# Altium schematic sheet A.SchDoc
size A3; SheetNumber: 1; SheetTotal: 5
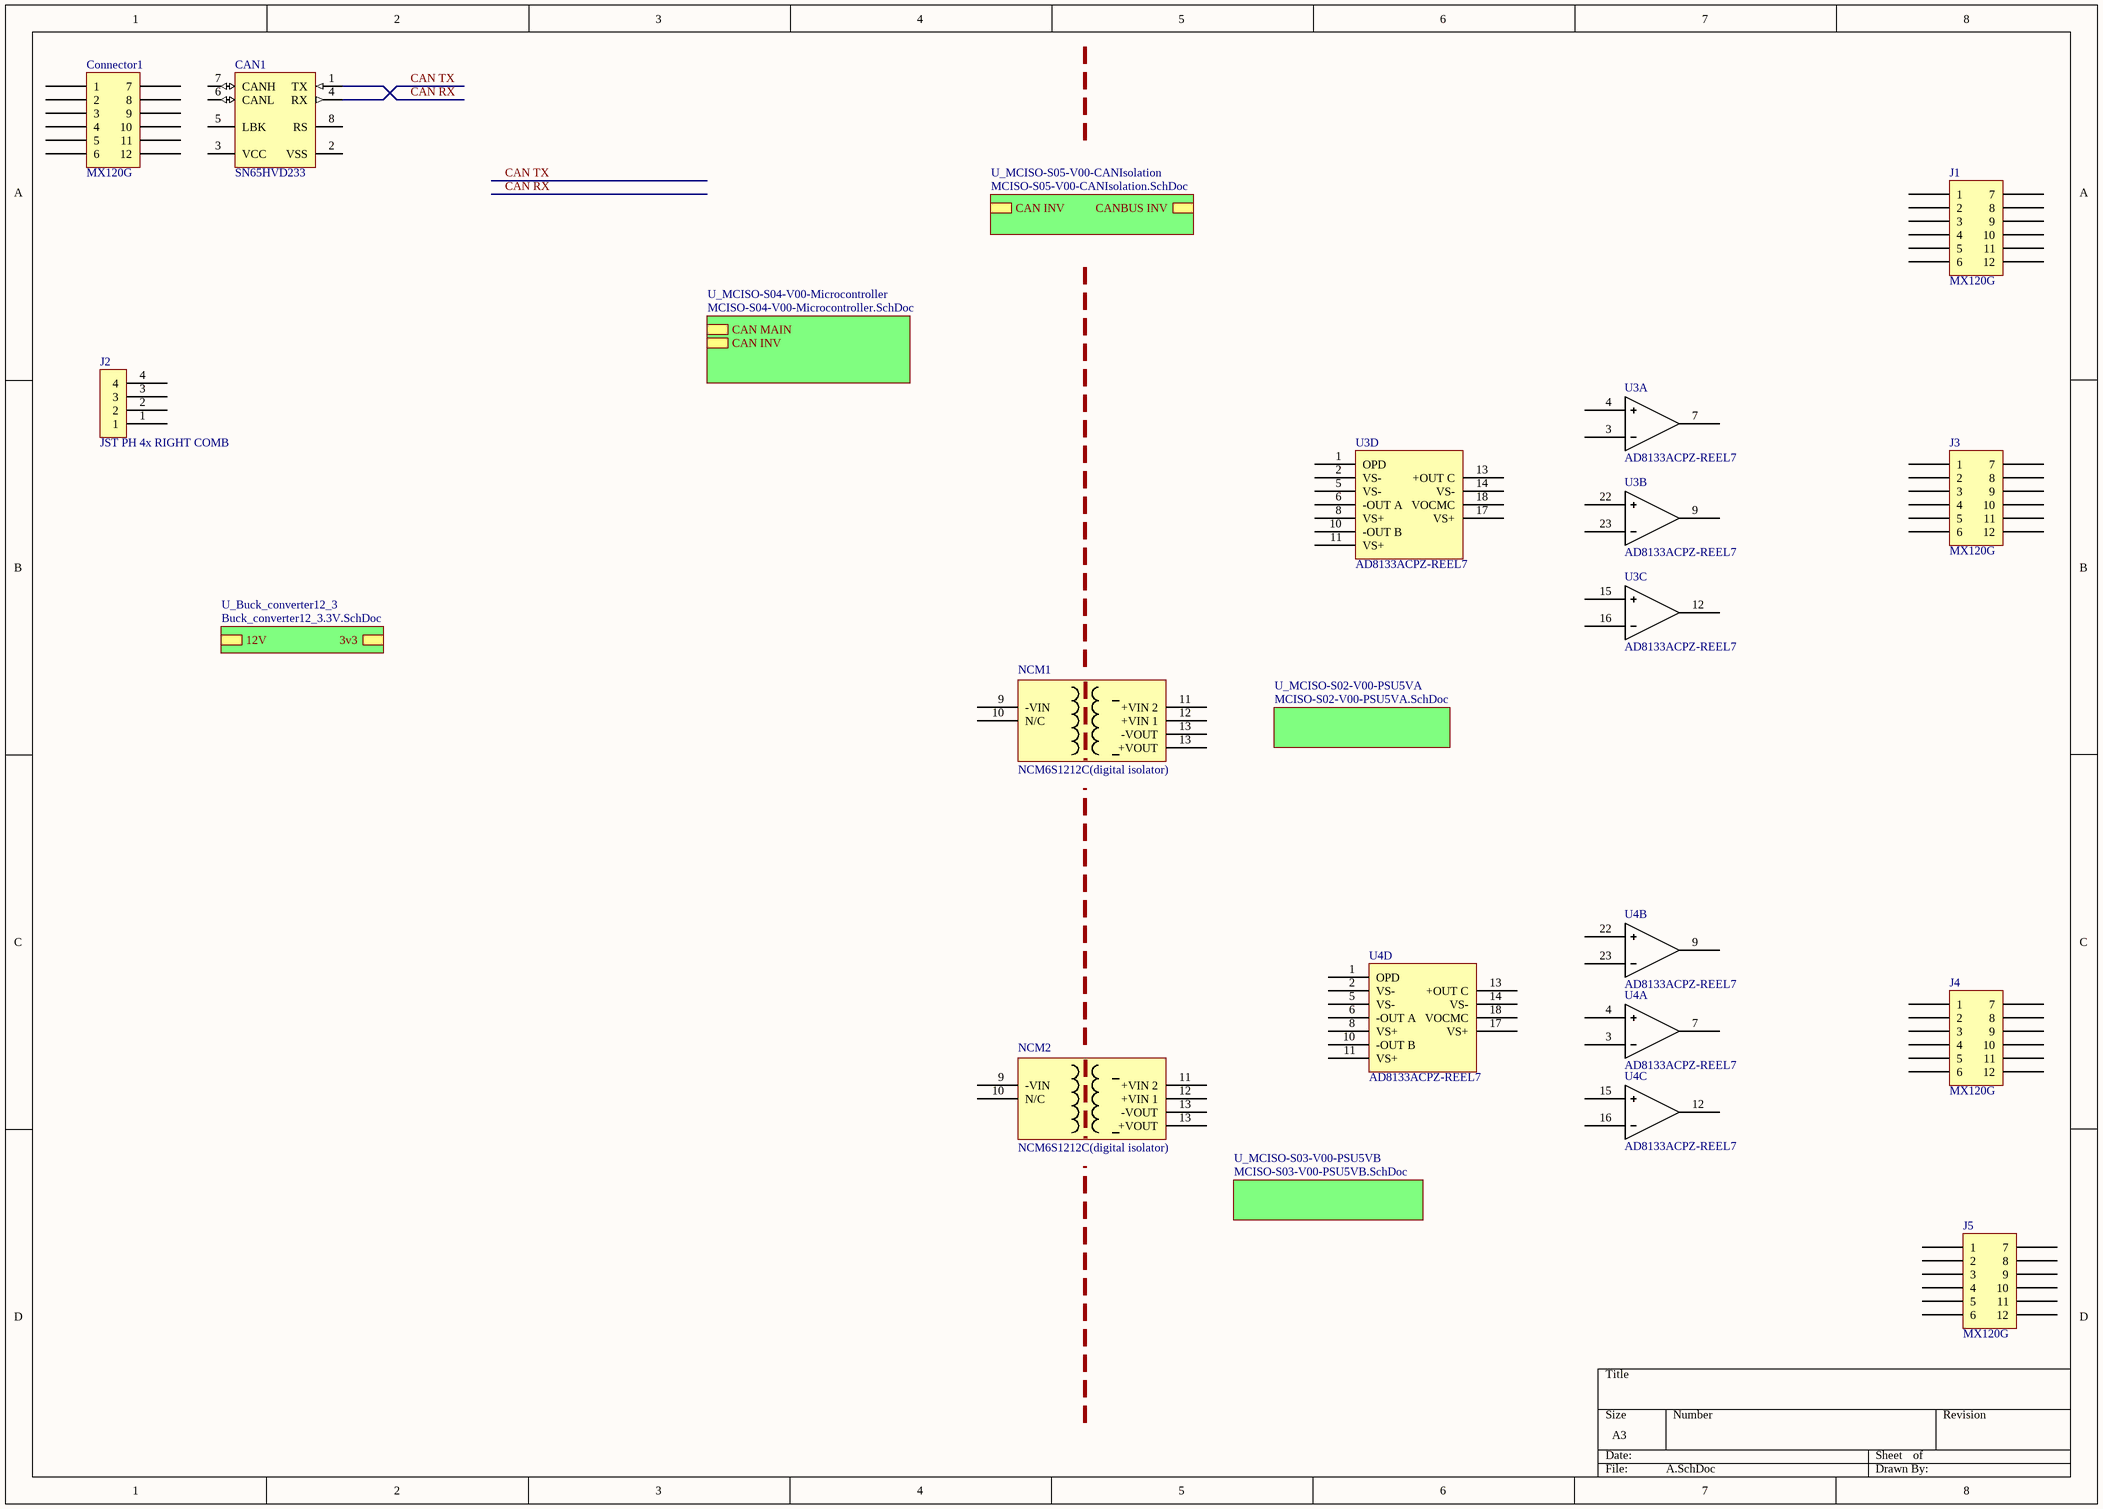
[diagram p0: A.SchDoc]

## Parts
CAN1  SN65HVD233  [SN65HVD233DR]
Connector1  MX120G  [MX120G]
J1  MX120G  [MX120G]
J2  JST PH 4x RIGHT COMB  [JST PH 4x RIGHT COMB]
J3  MX120G  [MX120G]
J4  MX120G  [MX120G]
J5  MX120G  [MX120G]
NCM1  NCM6S1212C(digital isolator)
NCM2  NCM6S1212C(digital isolator)
U3  AD8133ACPZ-REEL7  (parts A,B,C,D of 4)
U4  AD8133ACPZ-REEL7  (parts A,B,C,D of 4)

## Sub-sheets
U_Buck_converter12_3 = Buck_converter12_3.3V.SchDoc: 12V, 3v3
U_MCISO-S02-V00-PSU5VA = MCISO-S02-V00-PSU5VA.SchDoc: no entries
U_MCISO-S03-V00-PSU5VB = MCISO-S03-V00-PSU5VB.SchDoc: no entries
U_MCISO-S04-V00-Microcontroller = MCISO-S04-V00-Microcontroller.SchDoc: CAN MAIN (harness CAN MAIN), CAN INV (harness CAN INV)
U_MCISO-S05-V00-CANIsolation = MCISO-S05-V00-CANIsolation.SchDoc: CAN INV (harness CAN), CANBUS INV (harness CANBUS)

## Nets
CAN RX: CAN1.1(TX)
CAN TX: CAN1.4(RX)

Not connected (* = marked no-connect by the designer): CAN1 2(VSS) 3(VCC) 5(LBK) 6(CANL) 7(CANH) 8(RS); Connector1 1 2 3 4 5 6 7 8 9 10 11 12; J1 1 2 3 4 5 6 7 8 9 10 11 12; J2 1 2 3 4; J3 1 2 3 4 5 6 7 8 9 10 11 12; J4 1 2 3 4 5 6 7 8 9 10 11 12; J5 1 2 3 4 5 6 7 8 9 10 11 12; NCM1 9(-VIN) 10(N/C) 11(+VIN_2) 12(+VIN_1) 13(-VOUT); NCM2 9(-VIN) 10(N/C) 11(+VIN_2) 12(+VIN_1) 13(-VOUT); U3 1(OPD) 2(VS-) 3 4 5(VS-) 6(-OUT_A) 7 8(VS+) 9 10(-OUT_B) 11(VS+) 12 13(+OUT_C) 14(VS-) 15 16 17(VS+) 18(VOCMC) 22 23; U4 1(OPD) 2(VS-) 3 4 5(VS-) 6(-OUT_A) 7 8(VS+) 9 10(-OUT_B) 11(VS+) 12 13(+OUT_C) 14(VS-) 15 16 17(VS+) 18(VOCMC) 22 23

## Library data of the parts
Connector1 J1 J3-J5 = MX120G: MX120G with standard connector layout
U3 U4 = AD8133ACPZ-REEL7: Differential Amplifier 3 Circuit Differential 24-LFCSP-WQ (4x4)
CAN1 = SN65HVD233: ComponentLink1Description: LCSC; ComponentLink1URL: https://lcsc.com/product-detail/CAN-ICs_Texas-Instruments_SN65HVD233DRG4_Texas-Instruments-Texas-Instruments-SN65HVD233DRG4_C61643.html; ComponentLink2Description: Digikey; ComponentLink2URL: https://www.digikey.com.au/product-detail/en/texas-instruments/SN65HVD233DR/296-35967-1-ND/4134960; ComponentLink3Description: Datasheet; ComponentLink3URL: https://www.ti.com/lit/ds/symlink/sn65hvd233.pdf?ts=1588560888178; ComponentLink4Description: Ti Product Page; ComponentLink4URL: https://www.ti.com/product/SN65HVD233